# Altium schematic sheet 4_Channel_TVS.SchDoc
size A4; CompanyName: Technische Hochschule Nürnberg Georg Simon Ohm; Organization: UltraZohm; Address1: Kesslerplatz 12; Address2: 90489 Nürnberg; Address3: GERMANY; SheetNumber: 21; SheetTotal: 36; Website: www.ultrazohm.com
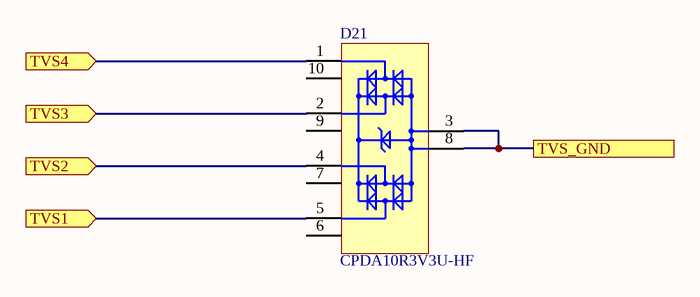
[diagram p0: 4_Channel_TVS.SchDoc]

## Parts
D21  CPDA10R3V3U-HF  [DFN230X100X55X10N]

## Ports
TVS1 (in), TVS2 (in), TVS3 (in), TVS4 (in), TVS_GND

## Nets
TVS1: D21.5 ; port TVS1
TVS2: D21.4 ; port TVS2
TVS3: D21.2 ; port TVS3
TVS4: D21.1 ; port TVS4
TVS_GND: D21.3 D21.8 ; port TVS_GND

Not connected (* = marked no-connect by the designer): D21 6 7 9 10

## Notes on the sheet
- Title
- Revision:
- Design Engineer:
- Date:
- Project:
- Sheet
- of

## Library data of the parts
D21 = 29054: AN: 29054; Voltage: 3.3V; Mixed: SMT; Temperature-Range: -55/+125; Extra: Diode Array TVS Diode ESD Protection 4-channel; Case: TSLP-9-1; HelpURL: b:\AD\adlib\datasheet\CPDA10R3V3U-HF\; H-ART: CPDA10R3V3U-HF